# Altium project Memory Address Register.PrjPcb
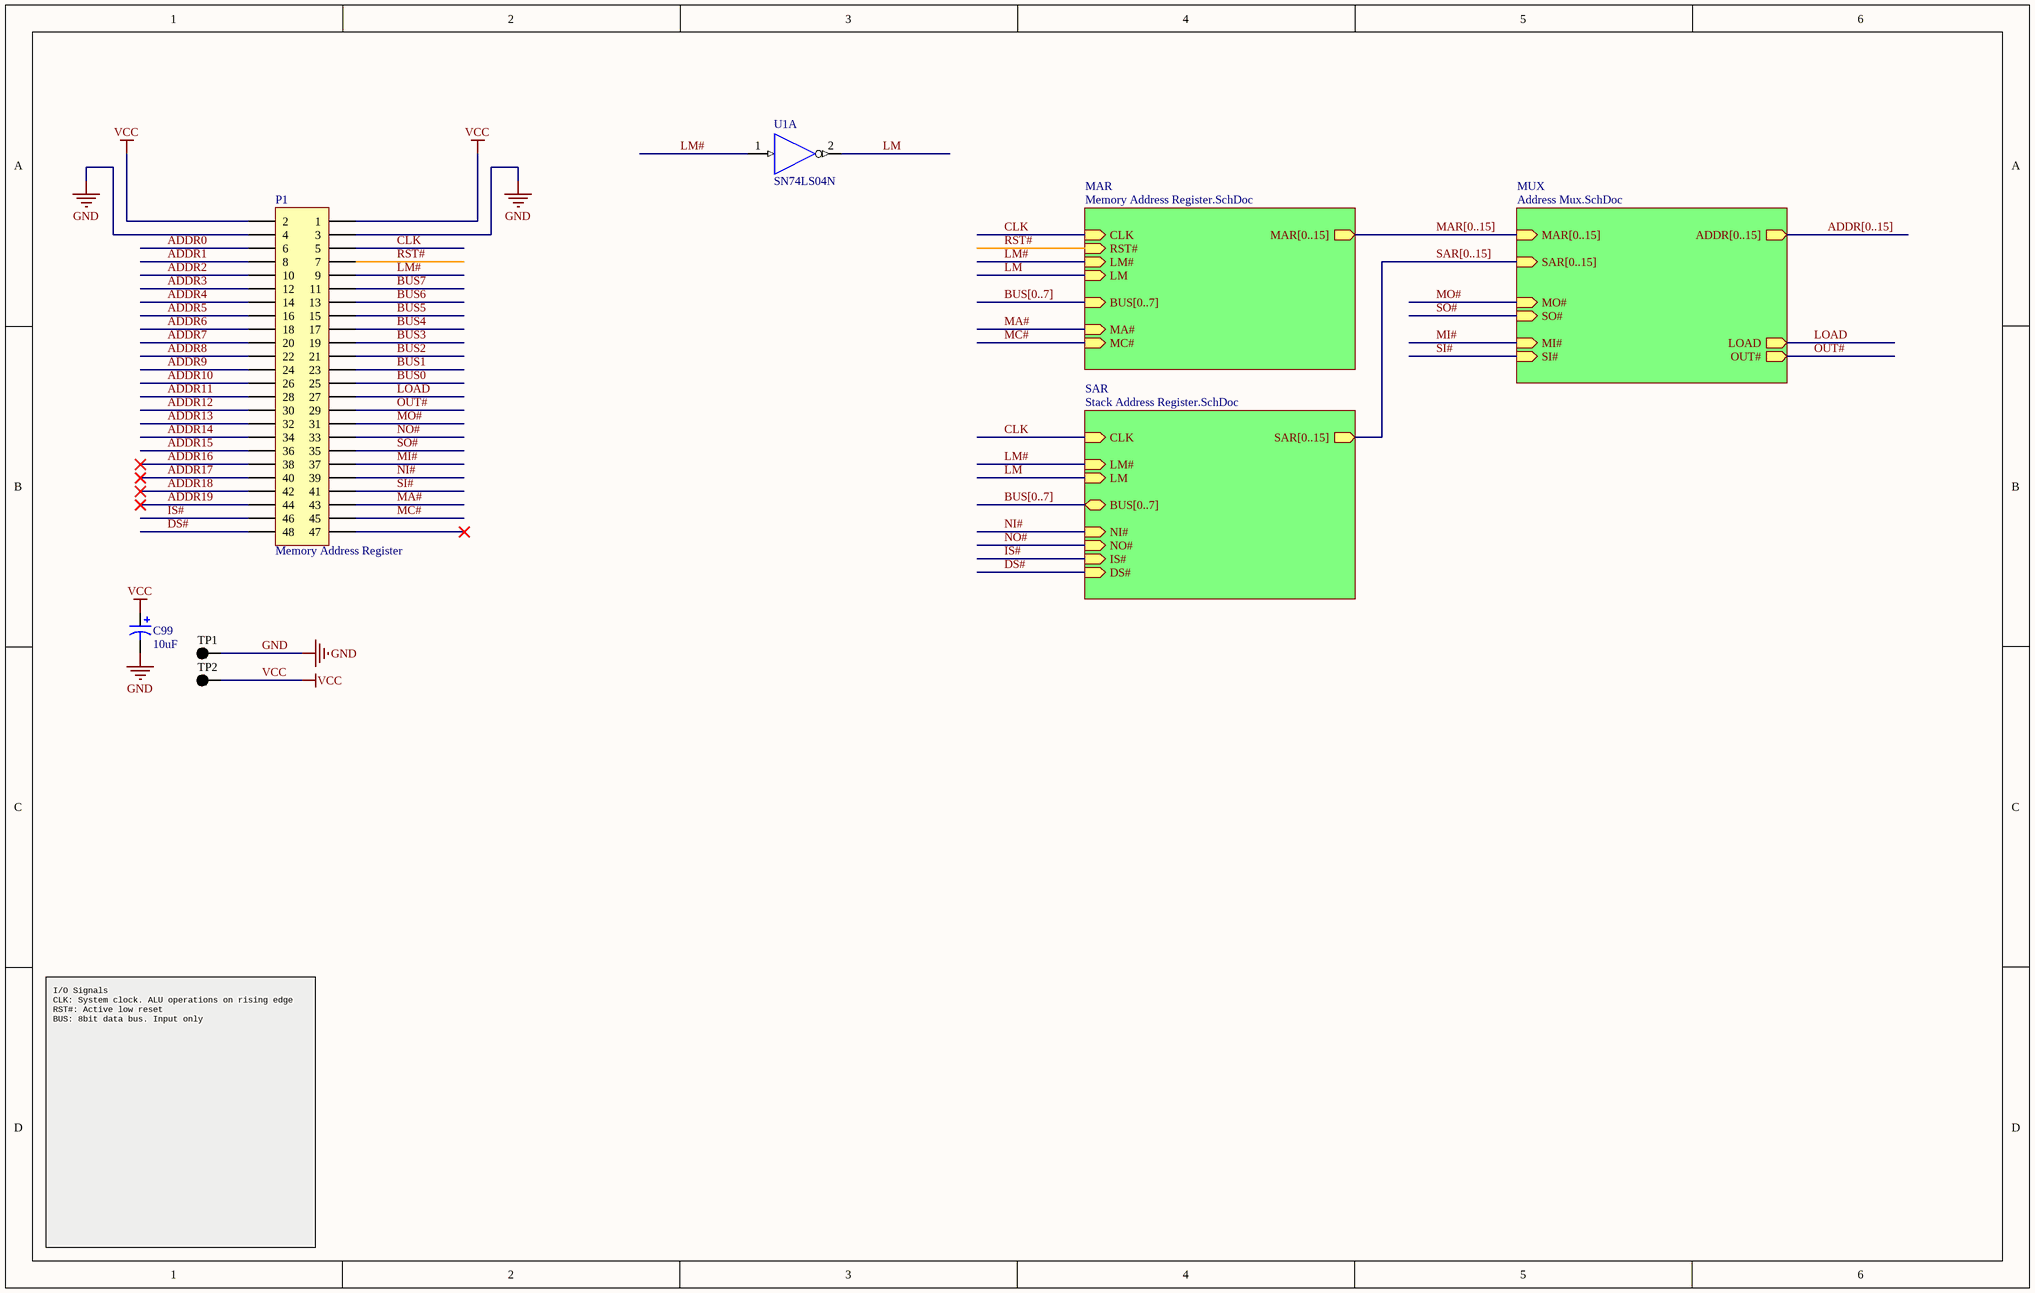
[diagram p0: Top.SchDoc]
2 sheets, 21 parts. Net scope: hierarchical (ports join the sheet entries above them; power ports are global).
Sheets:
  Top.SchDoc
    SAR = Stack Address Register.SchDoc

## Sheet Top.SchDoc
size B; Author: E. Sims; Organization: Let's Build Rockets Inc.; SheetNumber: 1; SheetTotal: 4

### Parts
C99  value 10uF  [C5x7]  (hidden comment: Cap Pol5)
P1  Memory Address Register  [HDR2X24H]
TP1  (no value)  [KSTN-5011_V]
TP2  (no value)  [KSTN-5011_V]
U1  SN74LS04N  [N014]  (part A of 6)

### Sub-sheets
MAR = Memory Address Register.SchDoc (file not in this document): CLK (in), MA# (in), LM# (in), MAR[0..15] (out), RST# (in), BUS[0..7] (in), MC# (in), LM (in)
MUX = Address Mux.SchDoc (file not in this document): MAR[0..15] (in), SAR[0..15] (in), ADDR[0..15] (out), LOAD (out), OUT# (out), MO# (in), SO# (in), MI# (in), SI# (in)
SAR = Stack Address Register.SchDoc: CLK (in), IS# (in), SAR[0..15] (out), DS# (in), NI# (in), BUS[0..7] (bidir), LM# (in), NO# (in), LM (in)

### Nets
GND: C99.2 P1.3 P1.4 TP1.1 U1.7(GND)
VCC: C99.1 P1.1 P1.2 TP2.1 U1.14(VCC)
ADDR0: P1.6
ADDR1: P1.8
ADDR2: P1.10
ADDR3: P1.12
ADDR4: P1.14
ADDR5: P1.16
ADDR6: P1.18
ADDR7: P1.20
ADDR8: P1.22
ADDR9: P1.24
ADDR10: P1.26
ADDR11: P1.28
ADDR12: P1.30
ADDR13: P1.32
ADDR14: P1.34
ADDR15: P1.36
ADDR16: P1.38
ADDR17: P1.40
ADDR18: P1.42
ADDR19: P1.44
BUS0: P1.25
BUS1: P1.23
BUS2: P1.21
BUS3: P1.19
BUS4: P1.17
BUS5: P1.15
BUS6: P1.13
BUS7: P1.11
CLK: P1.5 ; sheet MAR/CLK, sheet SAR/CLK
DS#: P1.48 ; sheet SAR/DS#
IS#: P1.46 ; sheet SAR/IS#
LM: U1.2(Y) ; sheet MAR/LM, sheet SAR/LM
LM#: P1.9 U1.1(A) ; sheet MAR/LM#, sheet SAR/LM#
LOAD: P1.27 ; sheet MUX/LOAD
MA#: P1.43 ; sheet MAR/MA#
MC#: P1.45 ; sheet MAR/MC#
MI#: P1.37 ; sheet MUX/MI#
MO#: P1.31 ; sheet MUX/MO#
NI#: P1.39 ; sheet SAR/NI#
NO#: P1.33 ; sheet SAR/NO#
OUT#: P1.29 ; sheet MUX/OUT#
RST#: P1.7 ; sheet MAR/RST#
SI#: P1.41 ; sheet MUX/SI#
SO#: P1.35 ; sheet MUX/SO#

Not connected (* = marked no-connect by the designer): P1 47*

### Buses and harness runs
bus ADDR[0..15] = sheet MUX/ADDR[0..15]
bus BUS[0..7] = sheet MAR/BUS[0..7]
bus BUS[0..7] = sheet SAR/BUS[0..7]
bus MAR[0..15] = sheet MAR/MAR[0..15] = sheet MUX/MAR[0..15]
bus SAR[0..15] = sheet MUX/SAR[0..15] = sheet SAR/SAR[0..15]

### Notes on the sheet
- I/O Signals
  CLK: System clock. ALU operations on rising edge
  RST#: Active low reset
  BUS: 8bit data bus. Input only
- Let's Build Rocket's Inc. Modular Paylaod System Based on TMP-010 Rev
  For more information visit https://github.com/LetsBuildRockets/Modular-Payload-System
  This work is licensed under CC BY-NC 4.0. To view a copy of this license, visit https://creativecommons.org/licenses/by-nc/4.0
- Title
- Size:
- Date:
- Assembly Variant:
- B
- Number:
- Time:
- Revision:
- Sheet
- of
- Author:
- File:

### Library data of the parts
C99 = Cap Pol5: Polarized Capacitor; Published: 8-Jun-2000; LatestRevisionDate: 17-Jul-2002; LatestRevisionNote: Re-released for DXP Platform.; PackageReference: POLAR0.8; Publisher: Altium Limited; PackageDescription: Polarized Capacitor; 2 Leads
P1 = Header 24x2H: Header, 24-Pin, Dual row, Right Angle; System: Connector; LatestRevisionDate: 17-Jul-2002; LatestRevisionNote: Re-released for DXP Platform.; Publisher: Altium Limited
TP1 TP2 = CMP-1672-00003-4: Test Point, Black, Through Hole, RoHS, Bulk; Manufacturer: Keystone; ComponentLink2URL: http://www.keyelco.com/product-pdf.cfm?p=1320; Colour: Black; Pins: 1; REACH SVHC: No SVHC; ComponentLink1URL: http://www.keyelco.com/; PackageReference: 5011; Contact Plating: Silver; Package Quantity: 100; Packaging: Bulk; RoHSCompliant: true; Height: 8.12 mm; PackageDescription: 1-Pin Through Hole Device, Dia 3.17 mm; Mount: Through Hole; Mounting Technology: Through Hole; DatasheetVersion: Rev. F, 12/2013; ComponentLink1Description: Manufacturer URL; Contact Material: Bronze; ComponentLink2Description: Datasheet
U1 = SN74LS04N: Hex Inverter; Published: 8-Jun-2000; LatestRevisionDate: 04-Mar-2005; LatestRevisionNote: Stylized 3D Model Added.; DatasheetVersion: Mar-1988; PackageVersion: Oct-1995; PackageReference: N014; Publisher: Altium Limited; PackageDescription: DIP; 14 Leads; Row Spacing 7.62 mm; Pitch 2.54 mm; ComponentLink1Description: Manufacturer Link; ComponentLink1URL: http://www.ti.com/; ComponentLink2Description: Datasheet; ComponentLink2URL: http://www-s.ti.com/sc/ds/sn74ls04.pdf

## Sheet Stack Address Register.SchDoc
size C portrait; Author: E. Sims; Organization: Let's Build Rockets Inc.; SheetNumber: 2; SheetTotal: 4
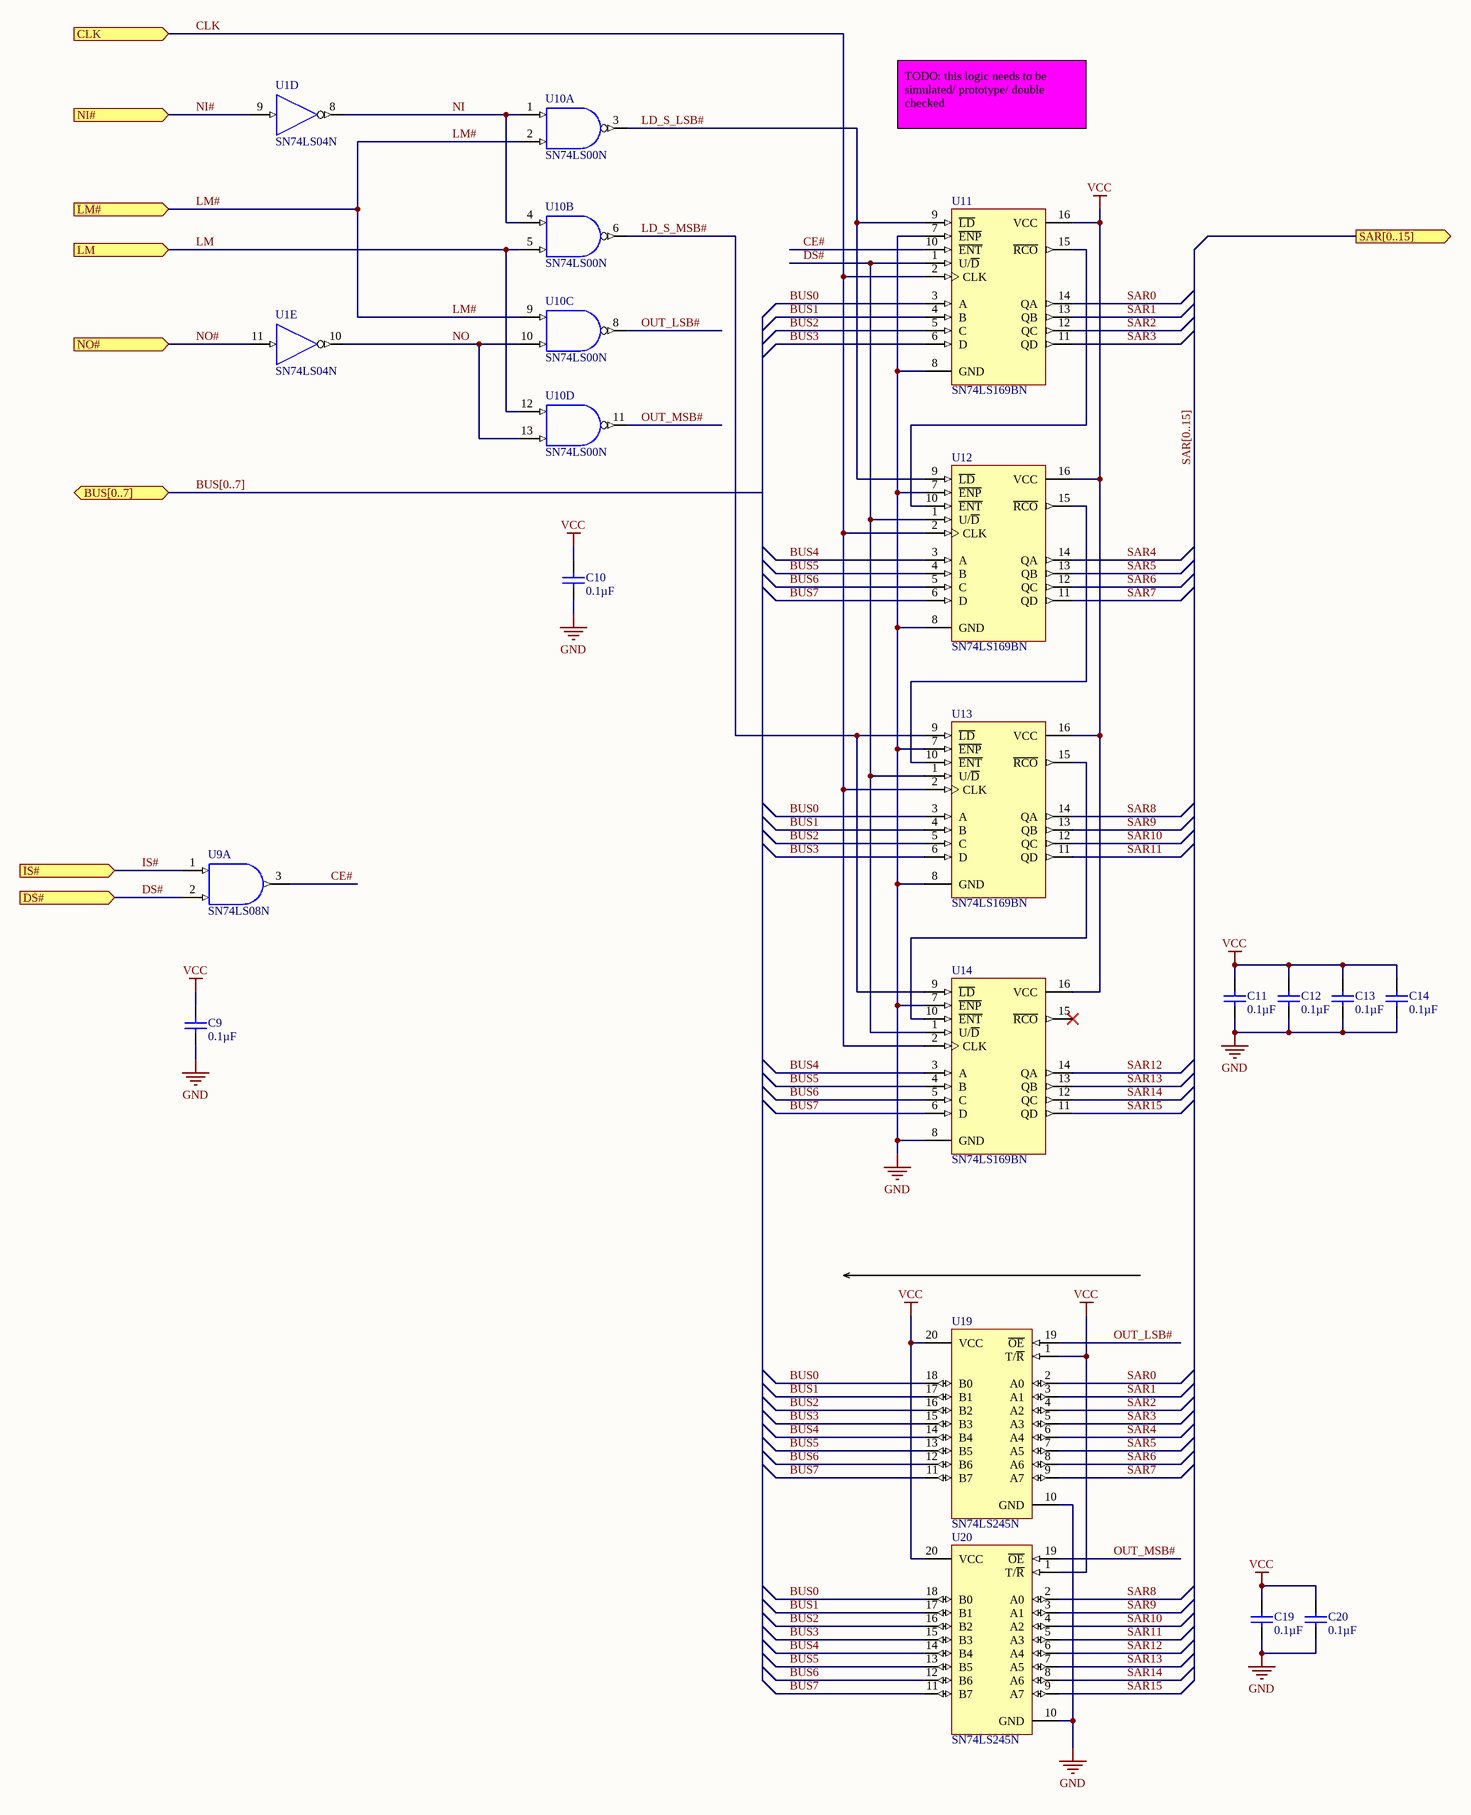
[diagram p1: Stack Address Register.SchDoc]

### Parts
C9  Capacitance: 0.1µF  [VISH-K104K15X7RF5TL2]  (hidden comment: K104K15X7RF5TL2)
C10  Capacitance: 0.1µF  [VISH-K104K15X7RF5TL2]  (hidden comment: K104K15X7RF5TL2)
C11  Capacitance: 0.1µF  [VISH-K104K15X7RF5TL2]  (hidden comment: K104K15X7RF5TL2)
C12  Capacitance: 0.1µF  [VISH-K104K15X7RF5TL2]  (hidden comment: K104K15X7RF5TL2)
C13  Capacitance: 0.1µF  [VISH-K104K15X7RF5TL2]  (hidden comment: K104K15X7RF5TL2)
C14  Capacitance: 0.1µF  [VISH-K104K15X7RF5TL2]  (hidden comment: K104K15X7RF5TL2)
C19  Capacitance: 0.1µF  [VISH-K104K15X7RF5TL2]  (hidden comment: K104K15X7RF5TL2)
C20  Capacitance: 0.1µF  [VISH-K104K15X7RF5TL2]  (hidden comment: K104K15X7RF5TL2)
U1  SN74LS04N  [N014]  (parts D,E of 6)
U9  SN74LS08N  [N014]  (part A of 4)
U10  SN74LS00N  [N014]  (parts A,B,C,D of 4)
U11  SN74LS169BN  [N016]
U12  SN74LS169BN  [N016]
U13  SN74LS169BN  [N016]
U14  SN74LS169BN  [N016]
U19  SN74LS245N  [N020]
U20  SN74LS245N  [N020]

### Ports
BUS[0..7] (bidir), CLK (in), DS# (in), IS# (in), LM (in), LM# (in), NI# (in), NO# (in), SAR[0..15] (out)

### Nets
GND: C9.2 C10.2 C11.2 C12.2 C13.2 C14.2 C19.2 C20.2 U1.7(GND) U9.7(GND) U10.7(GND) U11.7(~{ENP}) U11.8(GND) U12.7(~{ENP}) U12.8(GND) U13.7(~{ENP}) U13.8(GND) U14.7(~{ENP}) U14.8(GND) U19.10(GND) U20.10(GND)
VCC: C9.1 C10.1 C11.1 C12.1 C13.1 C14.1 C19.1 C20.1 U1.14(VCC) U9.14(VCC) U10.14(VCC) U11.16(VCC) U12.16(VCC) U13.16(VCC) U14.16(VCC) U19.1(T/~{R}) U19.20(VCC) U20.1(T/~{R}) U20.20(VCC)
BUS0: U11.3(A) U13.3(A) U19.18(B0) U20.18(B0)
BUS1: U11.4(B) U13.4(B) U19.17(B1) U20.17(B1)
BUS2: U11.5(C) U13.5(C) U19.16(B2) U20.16(B2)
BUS3: U11.6(D) U13.6(D) U19.15(B3) U20.15(B3)
BUS4: U12.3(A) U14.3(A) U19.14(B4) U20.14(B4)
BUS5: U12.4(B) U14.4(B) U19.13(B5) U20.13(B5)
BUS6: U12.5(C) U14.5(C) U19.12(B6) U20.12(B6)
BUS7: U12.6(D) U14.6(D) U19.11(B7) U20.11(B7)
CE#: U9.3(Y) U11.10(~{ENT})
CLK: U11.2(CLK) U12.2(CLK) U13.2(CLK) U14.2(CLK) ; port CLK
DS#: U9.2(B) U11.1(U/~{D}) U12.1(U/~{D}) U13.1(U/~{D}) U14.1(U/~{D}) ; port DS#
IS#: U9.1(A) ; port IS#
LD_S_LSB#: U10.3(Y) U11.9(~{LD}) U12.9(~{LD})
LD_S_MSB#: U10.6(Y) U13.9(~{LD}) U14.9(~{LD})
LM: U10.5(B) U10.12(A) ; port LM
LM#: U10.2(B) U10.9(A) ; port LM#
NI: U1.8(Y) U10.1(A) U10.4(A)
NI#: U1.9(A) ; port NI#
NO: U1.10(Y) U10.10(B) U10.13(B)
NO#: U1.11(A) ; port NO#
OUT_LSB#: U10.8(Y) U19.19(~{OE})
OUT_MSB#: U10.11(Y) U20.19(~{OE})
SAR0: U11.14(QA) U19.2(A0)
SAR1: U11.13(QB) U19.3(A1)
SAR2: U11.12(QC) U19.4(A2)
SAR3: U11.11(QD) U19.5(A3)
SAR4: U12.14(QA) U19.6(A4)
SAR5: U12.13(QB) U19.7(A5)
SAR6: U12.12(QC) U19.8(A6)
SAR7: U12.11(QD) U19.9(A7)
SAR8: U13.14(QA) U20.2(A0)
SAR9: U13.13(QB) U20.3(A1)
SAR10: U13.12(QC) U20.4(A2)
SAR11: U13.11(QD) U20.5(A3)
SAR12: U14.14(QA) U20.6(A4)
SAR13: U14.13(QB) U20.7(A5)
SAR14: U14.12(QC) U20.8(A6)
SAR15: U14.11(QD) U20.9(A7)
NetU11_15: U11.15(~{RCO}) U12.10(~{ENT})
NetU12_15: U12.15(~{RCO}) U13.10(~{ENT})
NetU13_15: U13.15(~{RCO}) U14.10(~{ENT})

Not connected (* = marked no-connect by the designer): U14 15(~{RCO})*

### Buses and harness runs
bus BUS[0..7] = port BUS[0..7]
bus SAR[0..15] = port SAR[0..15]

### Notes on the sheet
- TODO: this logic needs to be simulated/ prototype/ double checked
- Let's Build Rocket's Inc. Modular Paylaod System Based on TMP-010 Rev
  For more information visit https://github.com/LetsBuildRockets/Modular-Payload-System
  This work is licensed under CC BY-NC 4.0. To view a copy of this license, visit https://creativecommons.org/licenses/by-nc/4.0
- Title
- Size:
- Date:
- Assembly Variant:
- B
- Number:
- Time:
- Revision:
- Sheet
- of
- Author:
- File:

### Library data of the parts
C9-C14 C19 C20 = CMP-2000-06508-1: Ceramic Capacitor, 100 nF, +/- 10%, 50 V, -55 to 125 degC, 2-Pin THD, RoHS, Tape and Reel; Manufacturer: Vishay; Other Names: BC1084CT; Catalog Drawings: Mono-KapSide2-15_5.58Mono-KapSide1_15; Temperature Coefficient: X7R; Voltage - Rated: 50V; Online Catalog: Mono-Kap™Series; Size / Dimension: 0.157"Lx0.098"W(4.00mmx2.50mm); Operating Temperature: -55°C~125°C; Family: CeramicCapacitors; Manufacturer URL: http://www.vishay.com/; Standard Package: 1; Thickness (Max): -; Ratings: -; Datasheet Version: 08/2013; Package Description: 2-Pin Through Hole Device, Body 4 x 2.6 mm; Mounting Type: ThroughHole; Features: -; Lead Spacing: 0.098"(2.50mm); Tolerance: ±10%; Category: Capacitors; Mounting Technology: ThroughHole; Lead Style: Straight; Datasheet URL: http://www.vishay.com/docs/45171/kseries.pdf; Applications: GeneralPurpose; Package / Case: Radial; Height - Seated (Max): 0.220"(5.58mm); Package Reference: K104K15X7RF5TL2; Series: Mono-Kap™K; Packaging: CutTape(CT)
U1 = SN74LS04N: Hex Inverter; Published: 8-Jun-2000; LatestRevisionDate: 04-Mar-2005; LatestRevisionNote: Stylized 3D Model Added.; DatasheetVersion: Mar-1988; PackageVersion: Oct-1995; PackageReference: N014; Publisher: Altium Limited; PackageDescription: DIP; 14 Leads; Row Spacing 7.62 mm; Pitch 2.54 mm; ComponentLink1Description: Manufacturer Link; ComponentLink1URL: http://www.ti.com/; ComponentLink2Description: Datasheet; ComponentLink2URL: http://www-s.ti.com/sc/ds/sn74ls04.pdf
U9 = SN74LS08N: Quadruple 2-Input Positive-AND Gate; Published: 8-Jun-2000; LatestRevisionDate: 04-Mar-2005; LatestRevisionNote: Stylized 3D Model Added.; DatasheetVersion: Mar-1988; PackageVersion: Oct-1995; PackageReference: N014; Publisher: Altium Limited; PackageDescription: DIP; 14 Leads; Row Spacing 7.62 mm; Pitch 2.54 mm; ComponentLink1Description: Manufacturer Link; ComponentLink1URL: http://www.ti.com/; ComponentLink2Description: Datasheet; ComponentLink2URL: http://www-s.ti.com/sc/ds/SN74LS08.pdf
U10 = SN74LS00N: Quadruple 2-Input Positive-NAND Gate; Published: 8-Jun-2000; LatestRevisionDate: 04-Mar-2005; LatestRevisionNote: Stylized 3D Model Added.; DatasheetVersion: Mar-1988; PackageVersion: Oct-1995; PackageReference: N014; Publisher: Altium Limited; PackageDescription: DIP; 14 Leads; Row Spacing 7.62 mm; Pitch 2.54 mm; ComponentLink1Description: Manufacturer Link; ComponentLink1URL: http://www.ti.com/; ComponentLink2Description: Datasheet; ComponentLink2URL: http://www-s.ti.com/sc/ds/sn74ls00.pdf
U11-U14 = SN74LS169BN: Synchronous 4-Bit Up/Down Binary Counter; Published: 8-Jun-2000; LatestRevisionDate: 04-Mar-2005; LatestRevisionNote: Stylized 3D Model Added.; DatasheetVersion: Mar-1988; PackageVersion: Oct-1995; PackageReference: N016; Publisher: Altium Limited; PackageDescription: DIP; 16 Leads; Row Spacing 7.62 mm; Pitch 2.54 mm; Code_JEDEC: MS-001-BB; ComponentLink1Description: Manufacturer Link; ComponentLink1URL: http://www.ti.com/; ComponentLink2Description: Datasheet; ComponentLink2URL: http://www-s.ti.com/sc/ds/sn74ls169b.pdf
U19 U20 = SN74LS245N: Octal Bus Transceiver with 3-State Outputs; Published: 8-Jun-2000; LatestRevisionDate: 04-Mar-2005; LatestRevisionNote: Stylized 3D Model Added.; DatasheetVersion: Mar-1988; PackageVersion: Oct-1995; PackageReference: N020; Publisher: Altium Limited; PackageDescription: DIP; 20 Leads; Row Spacing 7.62 mm; Pitch 2.54 mm; ComponentLink1Description: Manufacturer Link; ComponentLink1URL: http://www.ti.com/; ComponentLink2Description: Datasheet; ComponentLink2URL: http://www-s.ti.com/sc/ds/sn74ls245.pdf

## Nets that join several sheets
GND: Top (5 pins), Stack Address Register (21 pins)
VCC: Top (5 pins), Stack Address Register (19 pins)
BUS0: Top (P1.25), Stack Address Register (U11.3 U13.3 U19.18 U20.18)
BUS1: Top (P1.23), Stack Address Register (U11.4 U13.4 U19.17 U20.17)
BUS2: Top (P1.21), Stack Address Register (U11.5 U13.5 U19.16 U20.16)
BUS3: Top (P1.19), Stack Address Register (U11.6 U13.6 U19.15 U20.15)
BUS4: Top (P1.17), Stack Address Register (U12.3 U14.3 U19.14 U20.14)
BUS5: Top (P1.15), Stack Address Register (U12.4 U14.4 U19.13 U20.13)
BUS6: Top (P1.13), Stack Address Register (U12.5 U14.5 U19.12 U20.12)
BUS7: Top (P1.11), Stack Address Register (U12.6 U14.6 U19.11 U20.11)
CLK: Top (P1.5), Stack Address Register (U11.2 U12.2 U13.2 U14.2)
DS#: Top (P1.48), Stack Address Register (5 pins)
IS#: Top (P1.46), Stack Address Register (U9.1)
LM: Top (U1.2), Stack Address Register (U10.5 U10.12)
LM#: Top (P1.9 U1.1), Stack Address Register (U10.2 U10.9)
NI#: Top (P1.39), Stack Address Register (U1.9)
NO#: Top (P1.33), Stack Address Register (U1.11)